# EAGLE design Breadboard_Nano_v3 (EAGLE 9.6.2)
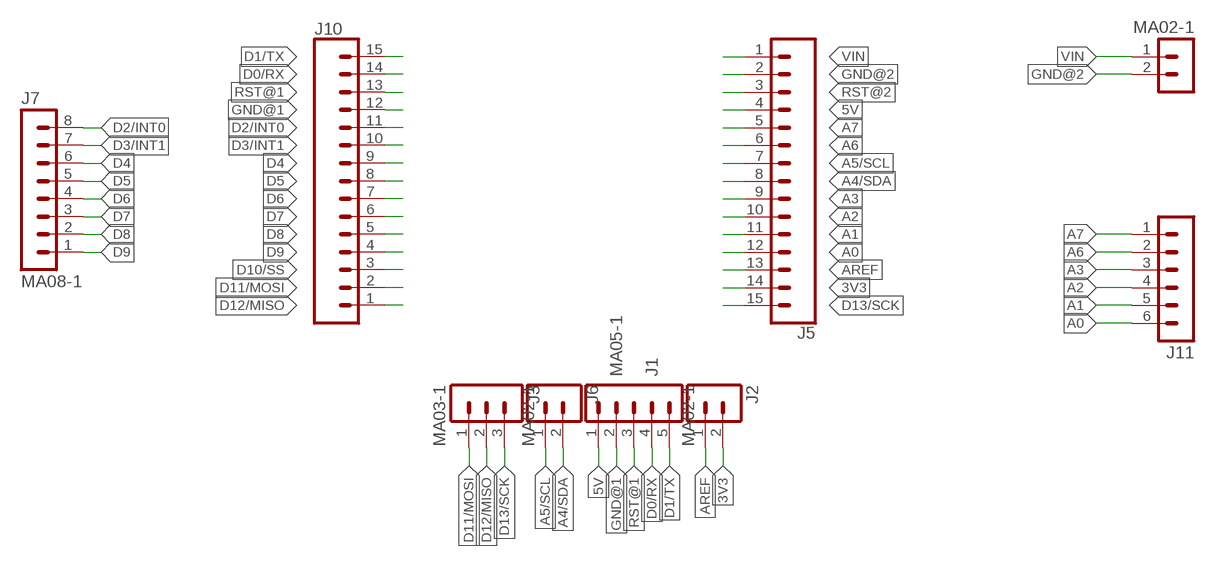
[diagram p0: schematic, sheet 1]

## Parts
J1  MA05-1  [MA05-1]
J2  MA02-1  [MA02-1]
J3  MA03-1  [MA03-1]
J5  CONN_15  [1X15]
J6  MA02-1  [MA02-1]
J7  MA08-1  [MA08-1]
J9  MA02-1  [MA02-1]
J10  CONN_15  [1X15]
J11  MA06-1  [MA06-1]

## Nets
3V3: J2.2 J5.14
5V: J1.1 J5.4
A0: J5.12 J11.6
A1: J5.11 J11.5
A2: J5.10 J11.4
A3: J5.9 J11.3
A4/SDA: J5.8 J6.2
A5/SCL: J5.7 J6.1
A6: J5.6 J11.2
A7: J5.5 J11.1
AREF: J2.1 J5.13
D0/RX: J1.4 J10.14
D1/TX: J1.5 J10.15
D2/INT0: J7.8 J10.11
D3/INT1: J7.7 J10.10
D4: J7.6 J10.9
D5: J7.5 J10.8
D6: J7.4 J10.7
D7: J7.3 J10.6
D8: J7.2 J10.5
D9: J7.1 J10.4
D10/SS: J10.3
D11/MOSI: J3.1 J10.2
D12/MISO: J3.2 J10.1
D13/SCK: J3.3 J5.15
GND@1: J1.2 J10.12
GND@2: J5.2 J9.2
RST@1: J1.3 J10.13
RST@2: J5.3
VIN: J5.1 J9.1

## Library data of the parts
J1 = 00_marph_CON_PinRows:MA05-1: Pin Header
J2 J6 J9 = 00_marph_connectors_IDC:MA02-1: Pin Header
J3 = 00_marph_connectors_IDC:MA03-1: Pin Header
J5 J10 = 00_marph_CON1:CONN_15: Multi connection point. Often used as Generic Header-pin footprint for 0.1 inch spaced/style header connections On any of the 0.1 inch spaced packages, you can populate with these: Break Away Headers - Straight <https://www.sparkfun.com/products/116> (PRT-00116) Break Away Male Headers - Right Angle <https://www.sparkfun.com/products/553> (PRT-00553) Female Headers <https://www.sparkfun.com/products/115> (PRT-00115) Break Away Headers - Machine Pin <https://www.sparkfun.com/products/117> (PRT-00117) Break Away Female Headers - Swiss Machine Pin <https://www.sparkfun.com/products/743> (PRT-00743) For SCREWTERMINALS and SPRING TERMINALS visit here: Screw Terimnals on SparkFun.com <https://www.sparkfun.com/search/results?term=Screw+Terminals> (5mm/3.5mm/2.54mm spacing) This device is also useful as a general connection point to wire up your design to another part of your project. Our various solder wires solder well into these plated through hole pads. Hook-Up Wire - Assortment (Stranded, 22 AWG) <https://www.sparkfun.com/products/11375> (PRT-11375) Hook-Up Wire - Assortment (Solid Core, 22 AWG) <https://www.sparkfun.com/products/11367> (PRT-11367) View the entire wire category on our website here <https://www.sparkfun.com/categories/141> Special notes: Molex polarized connector foot print use with SKU : PRT-08231 with associated crimp pins and housings. 1MM SMD Version SKU: PRT-10208 NOTES ON THE VARIANTS LOCK and LOCK_LONGPADS... This footprint was designed to help hold the alignment of a through-hole component (i.e. 6-pin header) while soldering it into place. You may notice that each hole has been shifted either up or down by 0.005 of an inch from it's more standard position (which is a perfectly straight line). This slight alteration caused the pins (the squares in the middle) to touch the edges of the holes. Because they are alternating, it causes a "brace" to hold the component in place. 0.005 has proven to be the perfect amount of "off-center" position when using our standard breakaway headers. Although looks a little odd when you look at the bare footprint, once you have a header in there, the alteration is very hard to notice. Also,if you push a header all the way into place, it is covered up entirely on the bottom side.
J7 = 00_marph_connectors_IDC:MA08-1: Pin Header
J11 = 00_marph_connectors_IDC:MA06-1: Pin Header

## Board
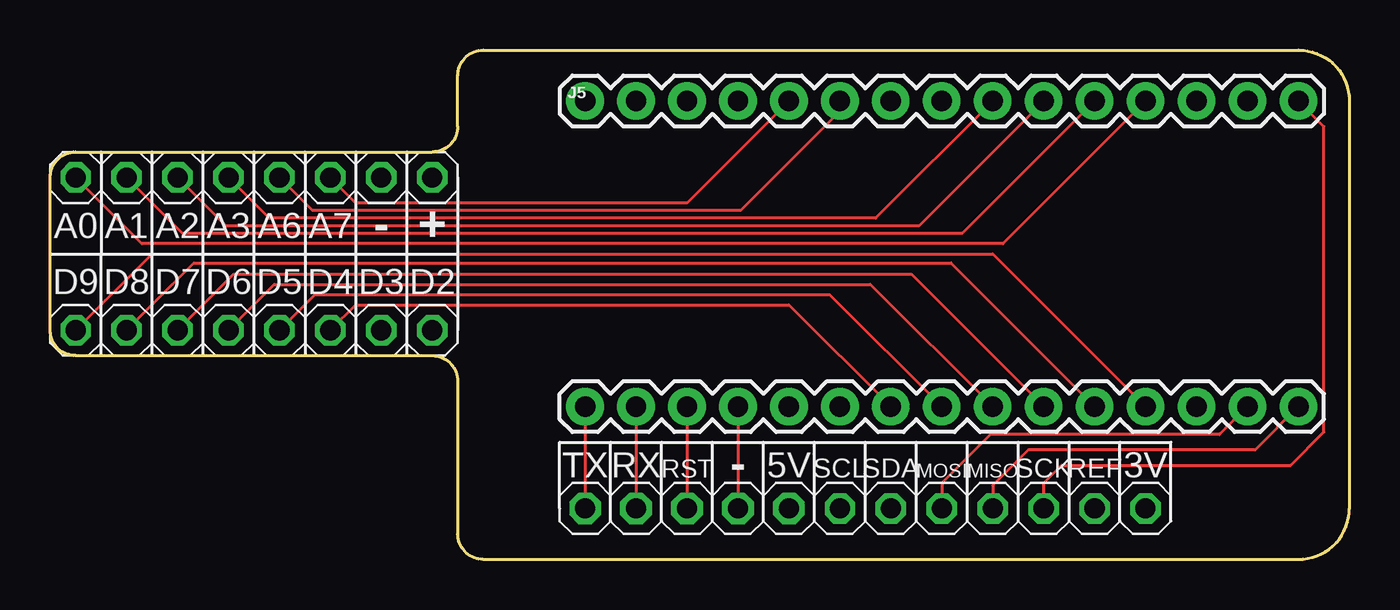
[diagram p1: board, top side]
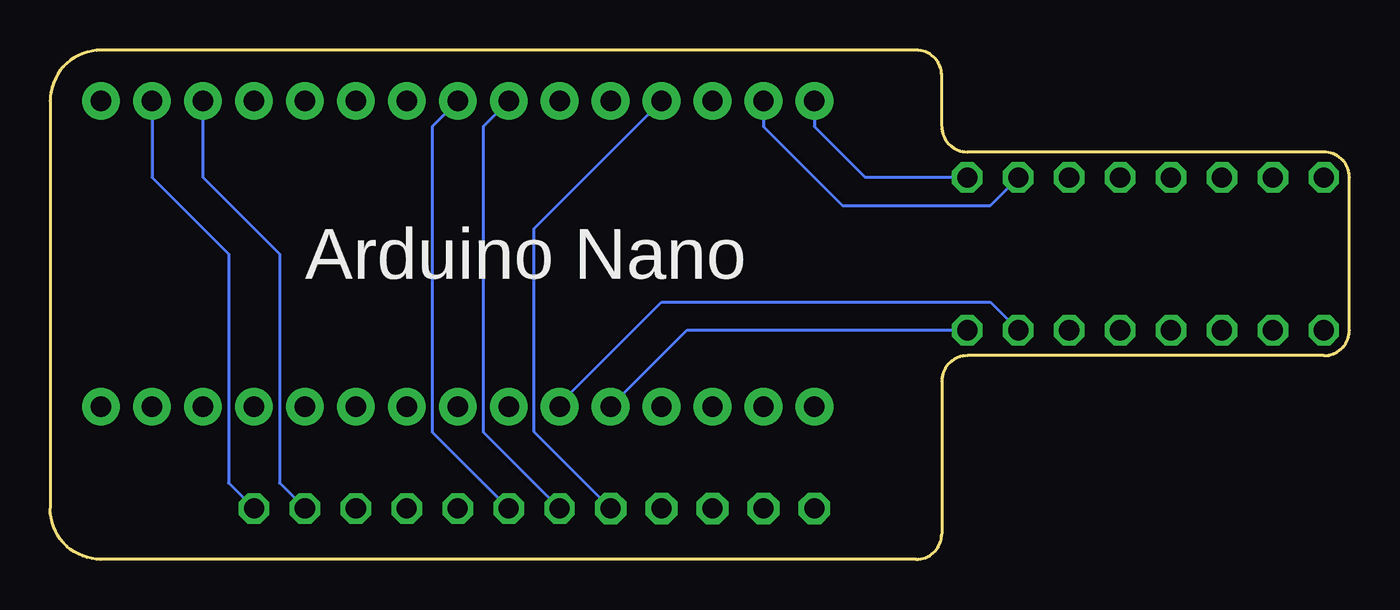
[diagram p2: board, bottom side, seen from below]

Size 64.77 x 25.4 mm. Coordinates in mm from the lower left corner, seen from the top.
Outline: 21.59,25.4 62.23,25.4 arc-90 64.77,22.86 64.77,2.54 arc-90 62.23,0 21.59,0 arc-90 20.32,1.27 20.32,8.89 arc90 19.05,10.16 1.27,10.16 arc-90 0,11.43 0,19.05 arc-90 1.27,20.32 19.05,20.32 arc90 20.32,21.59 20.32,24.13 arc-90 21.59,25.4
Copper layers (1*16): Top 0.035mm / dielectric 1.5mm / Bottom 0.035mm
Design rules "default": minimum track width 6mil, minimum drill 0.35mm, track to track 6mil, track to pad 6mil, pad to pad 6mil, via to via 6mil, smd to smd 6mil, copper to edge 40mil, drill to drill 6mil, minimum pad ring 10mil, minimum via ring 8mil, stop-mask expansion 4mil, vias tented up to drill 0mil, thermal gap 10mil

### Footprints (pad centres in the part's own frame; a part is rotated, then mirrored left to right if it is on the bottom)
MA05-1 = drill 1 pad 1.575 octagon: 1 0,5.08; 2 0,2.54; 3 0,0; 4 0,-2.54; 5 0,-5.08
MA02-1 = drill 1 octagon: 1 0,1.27; 2 0,-1.27
MA03-1 = drill 1 octagon: 1 0,2.54; 2 0,0; 3 0,-2.54
1X15 = drill 1.016 pad 1.88: 1 0,0; 2 2.54,0; 3 5.08,0; 4 7.62,0; 5 10.16,0; 6 12.7,0; 7 15.24,0; 8 17.78,0; 9 20.32,0; 10 22.86,0; 11 25.4,0; 12 27.94,0; 13 30.48,0; 14 33.02,0; 15 35.56,0
MA08-1 = drill 1 octagon: 1 0,8.89; 2 0,6.35; 3 0,3.81; 4 0,1.27; 5 0,-1.27; 6 0,-3.81; 7 0,-6.35; 8 0,-8.89
MA06-1 = drill 1 octagon: 1 0,6.35; 2 0,3.81; 3 0,1.27; 4 0,-1.27; 5 0,-3.81; 6 0,-6.35

### Placement (x,y rotation side)
J1  31.75,2.54 270 top
J2  53.34,2.54 90 top
J3  46.99,2.54 90 top
J5  26.67,22.86 0 top
J6  40.64,2.54 90 top
J7  10.16,11.43 90 top
J9  17.78,19.05 270 top
J10  62.23,7.62 180 top
J11  7.62,19.05 270 top

### Tracks (layer width: path | path; a pad name or v marks a point on that pad's centre or on a via)
3V3
  Bottom 0.152: J5.14 59.69,19.05 55.88,15.24 55.88,3.81 J2.2
5V
  Bottom 0.152: J1.1 40.64,6.35 40.64,16.51 J5.4
A0
  Top 0.152: J5.12 47.5,15.75 4.57,15.75 J11.6
A1
  Top 0.152: J5.11 45.47,16.26 6.6,16.26 J11.5
A2
  Top 0.152: J5.10 43.31,16.64 8.76,16.64 J11.4
A3
  Top 0.152: J5.9 41.15,17.02 10.92,17.02 J11.3
A4/SDA
  Bottom 0.152: J5.8 45.72,21.59 45.72,6.35 J6.2
A5/SCL
  Bottom 0.152: J5.7 43.18,21.59 43.18,6.35 J6.1
A6
  Top 0.152: J5.6 39.37,22.35 34.42,17.4 13.08,17.4 J11.2
A7
  Top 0.152: J11.1 15.24,17.78 31.75,17.78 J5.5
AREF
  Bottom 0.152: J2.1 53.34,3.81 53.34,15.24 57.15,19.05 J5.13
D0/RX
  Top 0.152: J10.14 J1.4
D1/TX
  Top 0.152: J10.15 J1.5
D2/INT0
  Bottom 0.152: J10.11 33.02,11.43 J7.8
D3/INT1
  Bottom 0.152: J10.10 39.37,7.75 34.29,12.83 17.91,12.83 J7.7
D4
  Top 0.152: J7.6 15.24,12.7 36.83,12.7 J10.9
D5
  Top 0.152: J7.5 13.21,13.21 38.86,13.21 J10.8
D6
  Top 0.152: J7.4 11.18,13.72 40.89,13.72 J10.7
D7
  Top 0.152: J7.3 9.14,14.22 42.93,14.22 J10.6
D8
  Top 0.152: J7.2 7.16,14.78 44.91,14.78 J10.5
D9
  Top 0.152: J7.1 5.08,15.24 46.99,15.24 J10.4
D11/MOSI
  Top 0.152: J10.2 58.29,6.22 46.86,6.22 44.45,3.81 J3.1
D12/MISO
  Top 0.152: J10.1 60.07,5.46 48.77,5.46 46.99,3.68 J3.2
D13/SCK
  Top 0.152: J3.3 49.53,3.81 50.42,4.7 61.85,4.7 63.5,6.35 63.5,21.59 J5.15
GND@1
  Top 0.152: J10.12 J1.2
GND@2
  Bottom 0.152: J9.2 17.91,17.65 25.27,17.65 29.21,21.59 J5.2
RST@1
  Top 0.152: J10.13 J1.3
VIN
  Bottom 0.152: J5.1 26.67,21.59 24.13,19.05 J9.1

### Text on the board
tNames: A0 | A1 | A2 | A3 | A6 | A7 | - | + | D9 | D8 | D7 | D6 | D5 | D4 | D3 | D2 | - | TX | RX | RST | 5V | SCL | SDA | MOSI | MISO | SCK | REF | 3V
bNames: Arduino Nano
Document: Arduino Nano | USB